# EAGLE design probe (EAGLE 9.6.2)
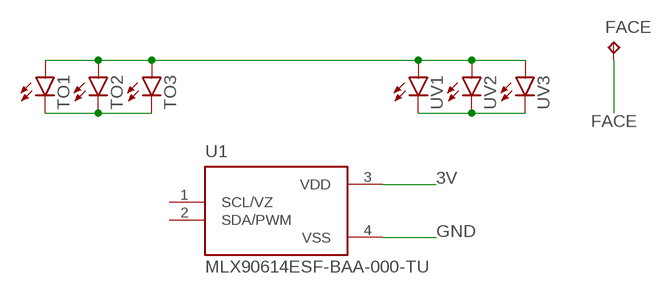
[diagram p0: schematic, sheet 1]

## Parts
FACE  TPTP14R  [TP14R]
TO1  LED5MM  [LED5MM]
TO2  LED5MM  [LED5MM]
TO3  LED5MM  [LED5MM]
U1  MLX90614ESF-BAA-000-TU  [TO254P942H425-4]
UV1  LED5MM  [LED5MM]
UV2  LED5MM  [LED5MM]
UV3  LED5MM  [LED5MM]

## Nets
3V: TO1.A TO2.A TO3.A U1.3(VDD) UV1.A UV2.A UV3.A
FACE: FACE.TP
GND: U1.4(VSS)
N$2: TO1.K(C) TO2.K(C) TO3.K(C)
N$4: UV1.K(C) UV2.K(C) UV3.K(C)
Unconnected: U1.1(SCL/VZ) U1.2(SDA/PWM)

## Library data of the parts
FACE = testpad:TP: Test pad
TO1-TO3 UV1-UV3 = general:LED: LED OSRAM: - CHIPLED LG R971, LG N971, LY N971, LG Q971, LY Q971, LO R971, LY R971 LH N974, LH R974 LS Q976, LO Q976, LY Q976 LO Q996 - Hyper CHIPLED LW Q18S LB Q993, LB Q99A, LB R99A - SideLED LS A670, LO A670, LY A670, LG A670, LP A670 LB A673, LV A673, LT A673, LW A673 LH A674 LY A675 LS A676, LA A676, LO A676, LY A676, LW A676 LS A679, LY A679, LG A679 - Hyper Micro SIDELED® LS Y876, LA Y876, LO Y876, LY Y876 LT Y87S - SmartLED LW L88C, LW L88S LB L89C, LB L89S, LG L890 LS L89K, LO L89K, LY L89K LS L896, LA L896, LO L896, LY L896 - TOPLED LS T670, LO T670, LY T670, LG T670, LP T670 LSG T670, LSP T670, LSY T670, LOP T670, LYG T670 LG T671, LOG T671, LSG T671 LB T673, LV T673, LT T673, LW T673 LH T674 LS T676, LA T676, LO T676, LY T676, LB T676, LH T676, LSB T676, LW T676 LB T67C, LV T67C, LT T67C, LS T67K, LO T67K, LY T67K, LW E67C LS E67B, LA E67B, LO E67B, LY E67B, LB E67C, LV E67C, LT E67C LW T67C LS T679, LY T679, LG T679 LS T770, LO T770, LY T770, LG T770, LP T770 LB T773, LV T773, LT T773, LW T773 LH T774 LS E675, LA E675, LY E675, LS T675 LS T776, LA T776, LO T776, LY T776, LB T776 LHGB T686 LT T68C, LB T68C - Hyper Mini TOPLED® LB M676 - Mini TOPLED Santana® LG M470 LS M47K, LO M47K, LY M47K Source: http://www.osram.convergy.de LUXEON: - LUMILED® LXK2-PW12-R00, LXK2-PW12-S00, LXK2-PW14-U00, LXK2-PW14-V00 LXK2-PM12-R00, LXK2-PM12-S00, LXK2-PM14-U00 LXK2-PE12-Q00, LXK2-PE12-R00, LXK2-PE12-S00, LXK2-PE14-T00, LXK2-PE14-U00 LXK2-PB12-K00, LXK2-PB12-L00, LXK2-PB12-M00, LXK2-PB14-N00, LXK2-PB14-P00, LXK2-PB14-Q00 LXK2-PR12-L00, LXK2-PR12-M00, LXK2-PR14-Q00, LXK2-PR14-R00 LXK2-PD12-Q00, LXK2-PD12-R00, LXK2-PD12-S00 LXK2-PH12-R00, LXK2-PH12-S00 LXK2-PL12-P00, LXK2-PL12-Q00, LXK2-PL12-R00 Source: www.luxeon.com KINGBRIGHT: KA-3528ASYC Source: www.kingbright.com
U1 = MLX90614ESF-BAA-000-TU:MLX90614ESF-BAA-000-TU: Temperature Sensor Digital, Infrared (IR) -40°C ~ 85°C 16 b TO-39 Check prices <https://pricing.snapeda.com/parts/MLX90614ESF-BAA-000-TU/Melexis/view-part?ref=eda>; AVAILABILITY: Bad; DESCRIPTION: Temperature Sensor Digital, Infrared (IR) -40°C ~ 85°C 16 b TO-39; MF: Melexis; MP: MLX90614ESF-BAA-000-TU; PACKAGE: TO-39 Melexis; PRICE: None; PURCHASE-URL: https://pricing.snapeda.com/search/part/MLX90614ESF-BAA-000-TU/?ref=eda

## Board
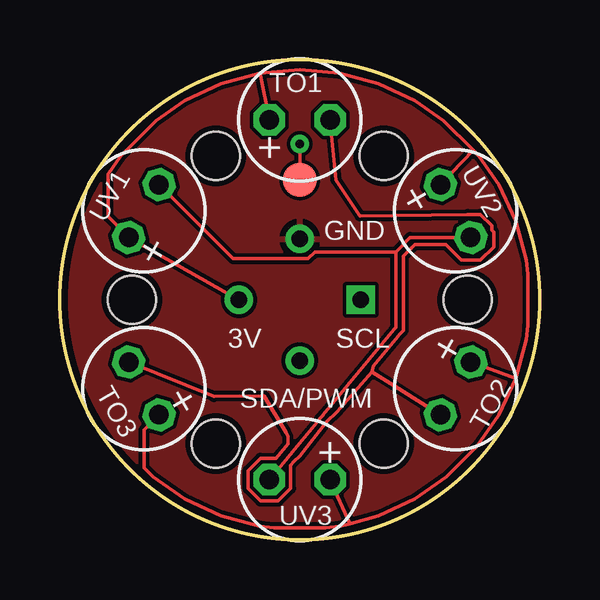
[diagram p1: board, top side]
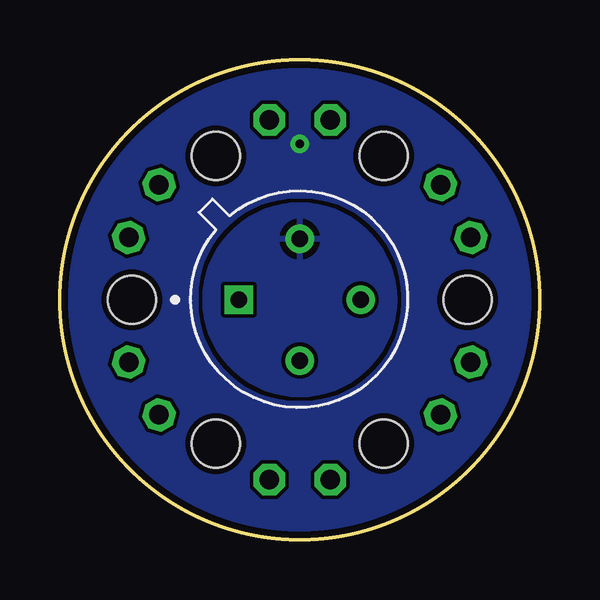
[diagram p2: board, bottom side, seen from below]

Size 20 x 20 mm. Coordinates in mm from the lower left corner, seen from the top.
Outline: circle at 10,10 radius 10
Copper layers (1*16): Top 0.035mm / dielectric 1.5mm / Bottom 0.035mm
Design rules "default *": minimum track width 6mil, minimum drill 0.35mm, track to track 6mil, track to pad 6mil, pad to pad 6mil, via to via 6mil, smd to smd 6mil, copper to edge 10mil, drill to drill 6mil, minimum pad ring 10mil, minimum via ring 8mil, stop-mask expansion 4mil, vias tented up to drill 0mil, thermal gap 10mil
Holes 2 mm at 6.5,16 3,10 6.5,4 13.5,4 17,10 13.5,16

### Footprints (pad centres in the part's own frame; a part is rotated, then mirrored left to right if it is on the bottom)
TP14R = smd 1.4 x 1.4: TP 0,0
LED5MM = drill 0.813 octagon: A -1.27,0; K 1.27,0
TO254P942H425-4 = drill 0.69 pad 1.09 square: 1 -2.54,0 | drill 0.69 pad 1.09: 2 0,-2.54; 3 2.54,0; 4 0,2.54

### Placement (x,y rotation side)
FACE  10,15 0 top
TO1  10,17.5 0 top
TO2  16.5,6.3 240 top
TO3  3.5,6.3 120 top
U1  10,10 0 bottom
UV1  3.5,13.7 60 top
UV2  16.5,13.7 300 top
UV3  10,2.5 180 top

### Tracks (layer width: path | path; a pad name or v marks a point on that pad's centre or on a via)
3V
  Top 0.152: U1.3 UV1.A 2,13.46 2,15.24 2.52,15.98 4.02,17.48 5.2,18.31 6.72,19.02 8.33,19.45 | 8.33,19.45 10,19.59 11.67,19.45 13.28,19.02 14.8,18.31 15.98,17.48 17.23,16.23 | 19.02,6.72 19.45,8.33 19.5,8.93 19.5,11.07 19.45,11.67 19.02,13.28 18.31,14.8 17.48,15.98 17.23,16.23 | 19.02,6.72 18.31,5.2 17.39,3.89 16.11,2.61 14.8,1.69 13.28,0.98 12.09,0.67 | 12.09,0.67 11.67,0.55 11.07,0.5 8.93,0.5 8.33,0.55 6.72,0.98 5.2,1.69 3.89,2.61 3.5,3 3.5,4.57 TO3.A | TO1.A 8.33,19.45 | UV2.A 17.23,16.23 | TO2.A 19.02,6.72 | UV3.A 12.09,0.67
FACE  (via drill 0.35)
  Top 0.152: FACE.TP v10,16.5
  pour Bottom (rank 5): -1,-1 -1,21 21,21 21,-1
GND
  pour Top: 0,0 0,20 20,20 20,0
  pour Bottom: 6,10 arc-90 10,14 arc-90 14,10 arc-90 10,6 arc-90
N$2
  Top 0.152: TO3.K 6.42,5.96 8.5,6 9.42,4.46 9.5,4.3 9.5,4 9,3.39 8.36,3.39 7.84,2.87 7.84,2.13 8.36,1.61 9.1,1.61 9.62,2.13 9.62,3.09 9.75,3.25 10,3.5 11.12,4.9 11.55,5.33 13,7 | 13,7 13.94,6.41 TO2.K | 13,7 13.07,7.24 14.1,8.47 14.17,8.55 14.32,8.71 14.32,11.82 14.79,12.29 16.09,12.29 16.74,11.65 17.53,11.65 18.09,12.21 18.09,12.82 18,12.91 18,13.08 17.53,13.55 17,13.55 12.5,13.5 11.5,15 TO1.K
N$4
  Top 0.152: UV3.K 9.99,4.01 10.82,5.01 10.82,5.03 10.89,5.1 10.96,5.19 10.97,5.19 13.94,8.76 | 13.94,8.76 | 13.94,8.76 14,8.84 14,12 | 14,12 14.6,12.6 UV2.K | 14,12 10.63,12 10.34,11.71 7.22,11.71 UV1.K

### Text on the board
tPlace: GND | 3V | SCL | SDA/PWM